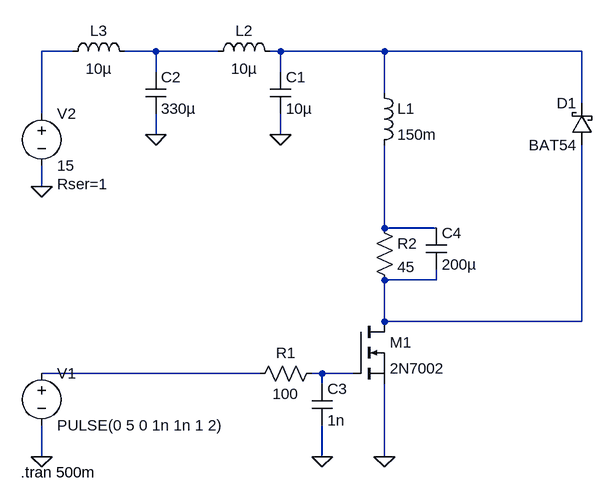
[diagram p0: schematic Relay_reduced_driver.asc]
Relay_reduced_driver.asc, the LTspice schematic file:
Version 4
SHEET 1 880 680
WIRE -240 -208 -288 -208
WIRE -112 -208 -160 -208
WIRE -16 -208 -112 -208
WIRE 80 -208 64 -208
WIRE 240 -208 80 -208
WIRE 544 -208 240 -208
WIRE -112 -176 -112 -208
WIRE 80 -176 80 -208
WIRE 240 -144 240 -208
WIRE 544 -128 544 -208
WIRE -288 -112 -288 -208
WIRE -112 -80 -112 -112
WIRE 80 -80 80 -112
WIRE -288 0 -288 -32
WIRE 240 64 240 -64
WIRE 320 64 240 64
WIRE 320 144 320 128
WIRE 320 144 240 144
WIRE 240 208 240 144
WIRE 544 208 544 -64
WIRE 544 208 240 208
WIRE 48 288 -288 288
WIRE 144 288 128 288
WIRE 192 288 144 288
WIRE 144 304 144 288
WIRE -288 416 -288 368
WIRE 144 416 144 368
WIRE 240 416 240 304
FLAG -288 0 0
FLAG -288 416 0
FLAG 240 416 0
FLAG -112 -80 0
FLAG 80 -80 0
FLAG 144 416 0
SYMBOL voltage -288 272 R0
WINDOW 123 0 0 Left 0
WINDOW 39 0 0 Left 0
SYMATTR InstName V1
SYMATTR Value PULSE(0 5 0 1n 1n 1 2)
SYMBOL voltage -288 -128 R0
WINDOW 123 0 0 Left 0
WINDOW 39 24 124 Left 2
SYMATTR SpiceLine Rser=1
SYMATTR InstName V2
SYMATTR Value 15
SYMBOL nmos 192 208 R0
SYMATTR InstName M1
SYMATTR Value 2N7002
SYMBOL ind 224 -160 R0
SYMATTR InstName L1
SYMATTR Value 150m
SYMATTR SpiceLine Rser=45
SYMBOL cap 64 -176 R0
SYMATTR InstName C1
SYMATTR Value 10µ
SYMATTR SpiceLine Rser=1m
SYMBOL cap -128 -176 R0
SYMATTR InstName C2
SYMATTR Value 330µ
SYMATTR SpiceLine Rser=0.5
SYMBOL schottky 560 -64 R180
WINDOW 0 24 64 Left 2
WINDOW 3 24 0 Left 2
SYMATTR InstName D1
SYMATTR Value BAT54
SYMATTR Description Diode
SYMATTR Type diode
SYMBOL ind -32 -192 R270
WINDOW 0 32 56 VTop 2
WINDOW 3 5 56 VBottom 2
SYMATTR InstName L2
SYMATTR Value 10µ
SYMATTR SpiceLine Rser=0.48
SYMBOL res 144 272 R90
WINDOW 0 0 56 VBottom 2
WINDOW 3 32 56 VTop 2
SYMATTR InstName R1
SYMATTR Value 100
SYMBOL cap 128 304 R0
SYMATTR InstName C3
SYMATTR Value 1n
SYMBOL ind -256 -192 R270
WINDOW 0 32 56 VTop 2
WINDOW 3 5 56 VBottom 2
SYMATTR InstName L3
SYMATTR Value 10µ
SYMATTR SpiceLine Rser=0.48
SYMBOL res 224 48 R0
SYMATTR InstName R2
SYMATTR Value 45
SYMBOL cap 304 64 R0
SYMATTR InstName C4
SYMATTR Value 200µ
TEXT -320 440 Left 2 !.tran 500m

The netlist it stands for:
* Relay_reduced_driver.asc
V1 N006 0 PULSE(0 5 0 1n 1n 1 2)
V2 N001 0 15 Rser=1
M1 N005 N007 0 0 2N7002
L1 N003 N004 150m Rser=45
C1 N003 0 10µ Rser=1m
C2 N002 0 330µ Rser=0.5
D1 N005 N003 BAT54
L2 N002 N003 10µ Rser=0.48
R1 N007 N006 100
C3 N007 0 1n
L3 N001 N002 10µ Rser=0.48
R2 N004 N005 45
C4 N004 N005 200µ
.model D D
.lib standard.dio
.model NMOS NMOS
.model PMOS PMOS
.lib standard.mos
.tran 500m
.backanno
.end